# Altium project BoardB.PrjPcb (part 1 of 2)
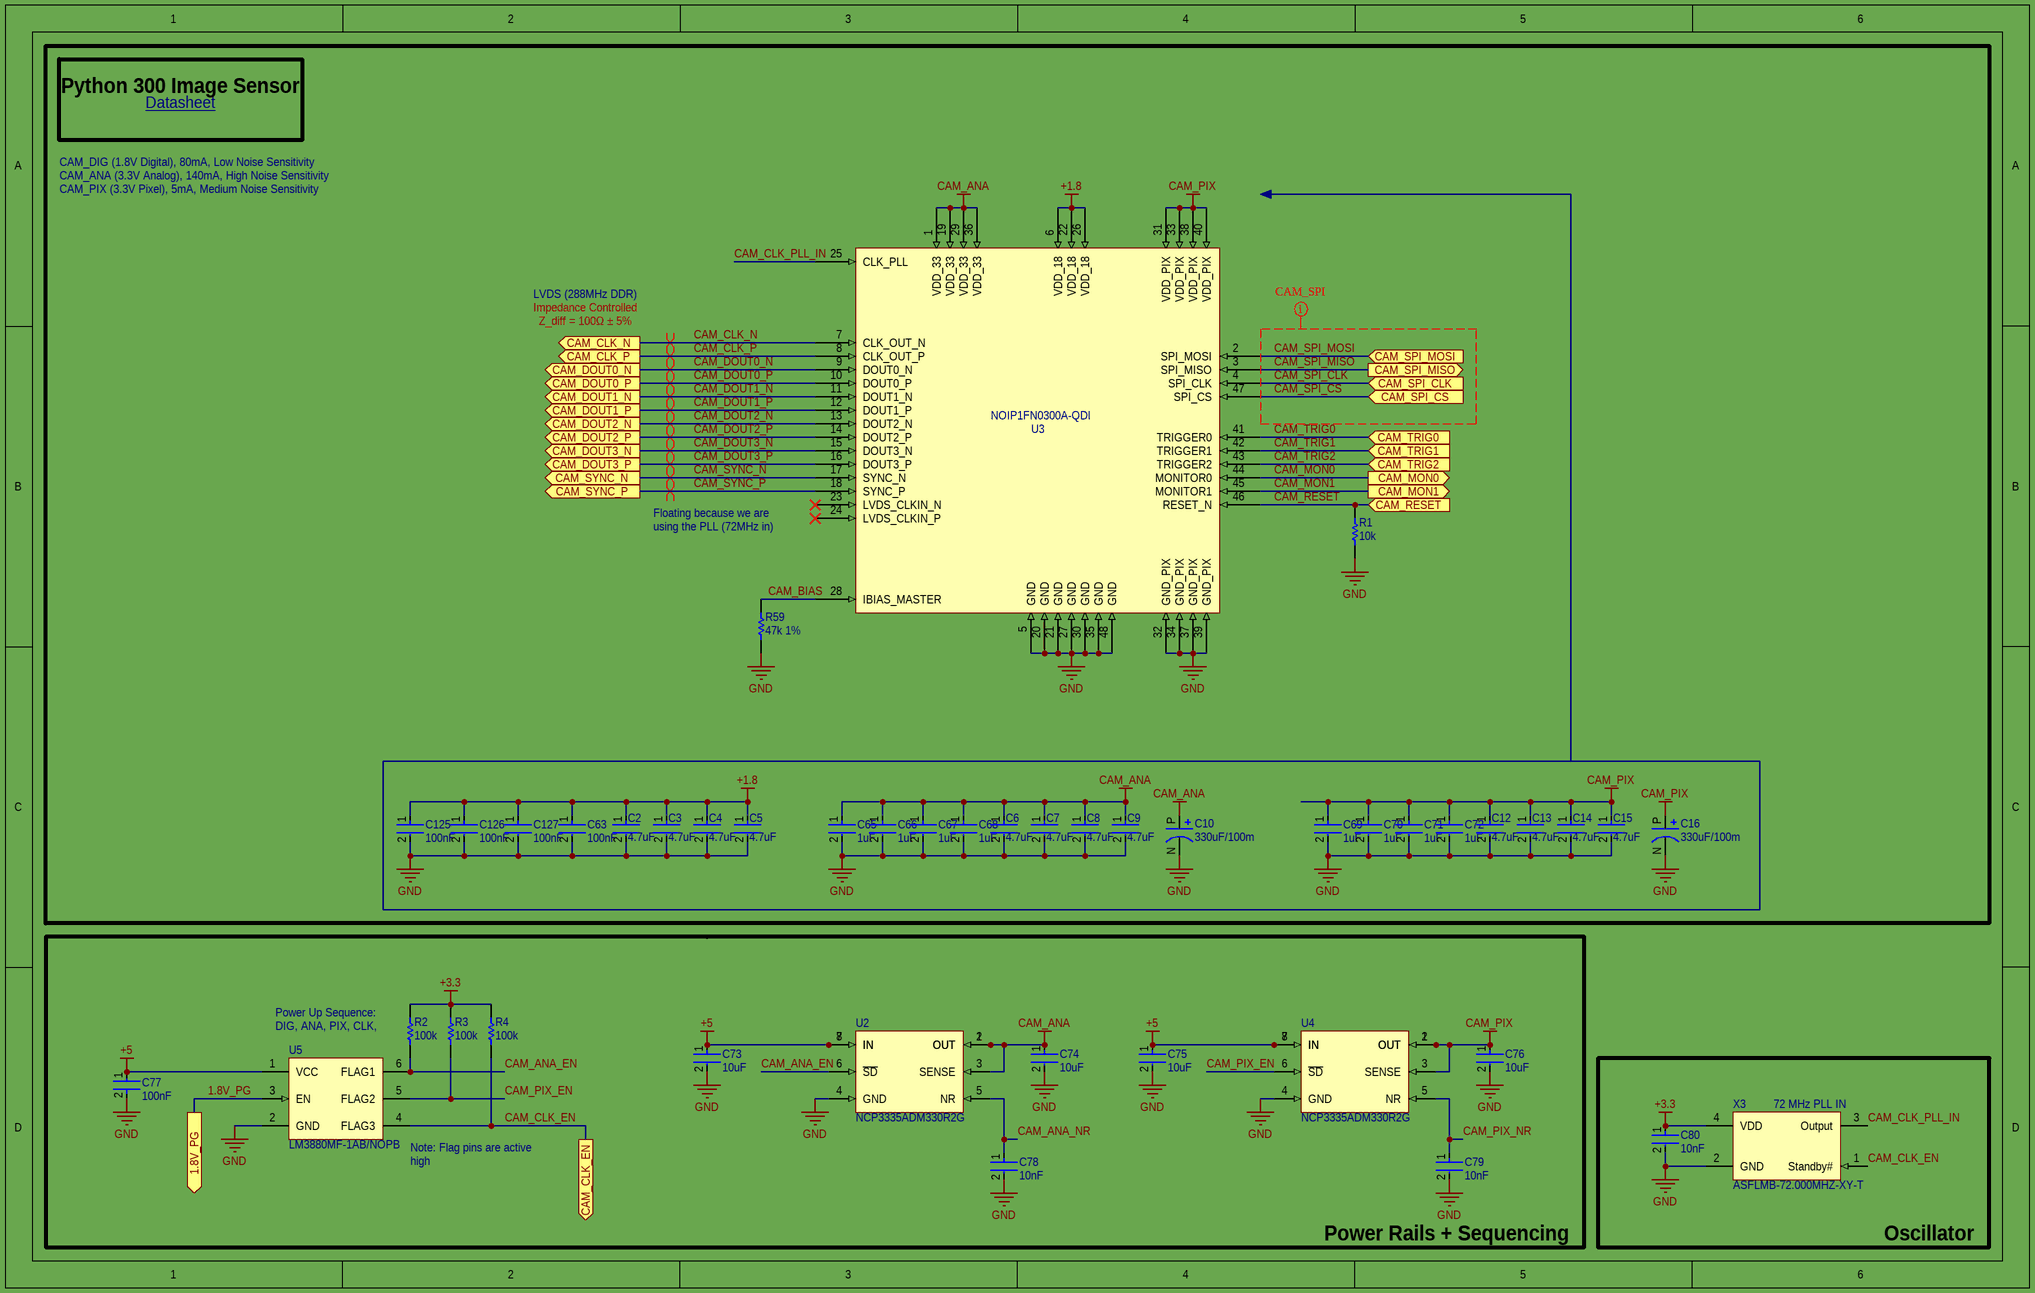
[diagram p0: BoardB-Python.SchDoc]
3 sheets, 129 parts. Net scope: flat (ports and power ports of the same name join across sheets).
Board file: BoardB.PcbDoc
Sheets:
  BoardB-Python.SchDoc
  BoardB-FPGA.SchDoc
  BoardB.SchDoc

## Sheet BoardB-Python.SchDoc
size B; SheetNumber: 1; SheetTotal: 3

### Parts
C2  4.7uF  [FP-GRM155-0_1-IPC_B]
C3  4.7uF  [FP-GRM155-0_1-IPC_B]
C4  4.7uF  [FP-GRM155-0_1-IPC_B]
C5  4.7uF  [FP-GRM155-0_1-IPC_B]
C6  4.7uF  [FP-GRM155-0_1-IPC_B]
C7  4.7uF  [FP-GRM155-0_1-IPC_B]
C8  4.7uF  [FP-GRM155-0_1-IPC_B]
C9  4.7uF  [FP-GRM155-0_1-IPC_B]
C10  330uF/100m  [NOSD337M004R0100]
C12  4.7uF  [FP-GRM155-0_1-IPC_B]
C13  4.7uF  [FP-GRM155-0_1-IPC_B]
C14  4.7uF  [FP-GRM155-0_1-IPC_B]
C15  4.7uF  [FP-GRM155-0_1-IPC_B]
C16  330uF/100m  [NOSD337M004R0100]
C63  100nF  [FP-C0402-BB-MFG]
C65  1uF  [FP-GRM15-0_1-MFG]
C66  1uF  [FP-GRM15-0_1-MFG]
C67  1uF  [FP-GRM15-0_1-MFG]
C68  1uF  [FP-GRM15-0_1-MFG]
C69  1uF  [FP-GRM15-0_1-MFG]
C70  1uF  [FP-GRM15-0_1-MFG]
C71  1uF  [FP-GRM15-0_1-MFG]
C72  1uF  [FP-GRM15-0_1-MFG]
C73  10uF  [FP-CL05A106MP5NUNC-MFG]
C74  10uF  [FP-CL05A106MP5NUNC-MFG]
C75  10uF  [FP-CL05A106MP5NUNC-MFG]
C76  10uF  [FP-CL05A106MP5NUNC-MFG]
C77  100nF  [FP-GRM15-MFG]
C78  10nF  [FP-CC0402-MFG]
C79  10nF  [FP-CC0402-MFG]
C80  10nF  [FP-CC0402-MFG]
C125  100nF  [FP-C0402-BB-MFG]
C126  100nF  [FP-C0402-BB-MFG]
C127  100nF  [FP-C0402-BB-MFG]
R1  10k  [RESC1005X40X25LL05T05]
R2  100k  [RESC1005X40X25ML05T10]
R3  100k  [RESC1005X40X25ML05T10]
R4  100k  [RESC1005X40X25ML05T10]
R59  47k 1%  [RESC1005X40X25NL05T05]
U2  NCP3335ADM330R2G  [NCP3335ADM330R2G]
U3  NOIP1FN0300A-QDI  [NOIP1FN0300A-QDI]
U4  NCP3335ADM330R2G  [NCP3335ADM330R2G]
U5  LM3880MF-1AB/NOPB  [DBV0006A_M]
X3  ASFLMB-72.000MHZ-XY-T  [ASFLMB-72.000MHZ-XY-T]

### Blocks framed on the sheet
Python 300 Image Sensor: C2-C10 C12-C16 C63 C65-C72 C125-C127 R1 R59 U3
Power Rails + Sequencing: C73-C79 R2-R4 U2 U4 U5
Oscillator: C80 X3

### Ports
1.8V_PG (out), CAM_CLK_EN (out), CAM_CLK_N (out), CAM_CLK_P (out), CAM_DOUT0_N (out), CAM_DOUT0_P (out), CAM_DOUT1_N (out), CAM_DOUT1_P (out), CAM_DOUT2_N (out), CAM_DOUT2_P (out), CAM_DOUT3_N (out), CAM_DOUT3_P (out), CAM_MON0 (out), CAM_MON1 (out), CAM_RESET (in), CAM_SPI_CLK (in), CAM_SPI_CS (in), CAM_SPI_MISO (out), CAM_SPI_MOSI (in), CAM_SYNC_N (out), CAM_SYNC_P (out), CAM_TRIG0 (in), CAM_TRIG1 (in), CAM_TRIG2 (in)

### Nets
+1.8: C2.1 C3.1 C4.1 C5.1 C63.1 C125.1 C126.1 C127.1 U3.6(VDD_18) U3.22(VDD_18) U3.26(VDD_18)
+3.3: C80.1 R2.2 R3.2 R4.2 X3.4(VDD)
+5: C73.1 C75.1 C77.1 U2.7(IN) U2.8(IN) U4.7(IN) U4.8(IN) U5.1(VCC)
CAM_ANA: C6.1 C7.1 C8.1 C9.1 C10.P C65.1 C66.1 C67.1 C68.1 C74.1 U2.1(OUT) U2.2(OUT) U2.3(SENSE) U3.1(VDD_33) U3.19(VDD_33) U3.29(VDD_33) U3.36(VDD_33)
CAM_PIX: C12.1 C13.1 C14.1 C15.1 C16.P C69.1 C70.1 C71.1 C72.1 C76.1 U3.31(VDD_PIX) U3.33(VDD_PIX) U3.38(VDD_PIX) U3.40(VDD_PIX) U4.1(OUT) U4.2(OUT) U4.3(SENSE)
GND: C2.2 C3.2 C4.2 C5.2 C6.2 C7.2 C8.2 C9.2 C10.N C12.2 C13.2 C14.2 C15.2 C16.N C63.2 C65.2 C66.2 C67.2 C68.2 C69.2 C70.2 C71.2 C72.2 C73.2 C74.2 C75.2 C76.2 C77.2 C78.2 C79.2 C80.2 C125.2 C126.2 C127.2 R1.1 R59.1 U2.4(GND) U3.5(GND) U3.20(GND) U3.21(GND) U3.27(GND) U3.30(GND) U3.32(GND_PIX) U3.34(GND_PIX) U3.35(GND) U3.37(GND_PIX) U3.39(GND_PIX) U3.48(GND) U4.4(GND) U5.2(GND) X3.2(GND)
1.8V_PG: U5.3(EN) ; port 1.8V_PG
CAM_ANA_EN: R2.1 U2.6(~{SD}) U5.6(FLAG1)
CAM_ANA_NR: C78.1 U2.5(NR)
CAM_BIAS: R59.2 U3.28(IBIAS_MASTER)
CAM_CLK_EN: R4.1 U5.4(FLAG3) X3.1(Standby#) ; port CAM_CLK_EN
CAM_CLK_N: U3.7(CLK_OUT_N) ; port CAM_CLK_N
CAM_CLK_P: U3.8(CLK_OUT_P) ; port CAM_CLK_P
CAM_CLK_PLL_IN: U3.25(CLK_PLL) X3.3(Output)
CAM_DOUT0_N: U3.9(DOUT0_N) ; port CAM_DOUT0_N
CAM_DOUT0_P: U3.10(DOUT0_P) ; port CAM_DOUT0_P
CAM_DOUT1_N: U3.11(DOUT1_N) ; port CAM_DOUT1_N
CAM_DOUT1_P: U3.12(DOUT1_P) ; port CAM_DOUT1_P
CAM_DOUT2_N: U3.13(DOUT2_N) ; port CAM_DOUT2_N
CAM_DOUT2_P: U3.14(DOUT2_P) ; port CAM_DOUT2_P
CAM_DOUT3_N: U3.15(DOUT3_N) ; port CAM_DOUT3_N
CAM_DOUT3_P: U3.16(DOUT3_P) ; port CAM_DOUT3_P
CAM_MON0: U3.44(MONITOR0) ; port CAM_MON0
CAM_MON1: U3.45(MONITOR1) ; port CAM_MON1
CAM_PIX_EN: R3.1 U4.6(~{SD}) U5.5(FLAG2)
CAM_PIX_NR: C79.1 U4.5(NR)
CAM_RESET: R1.2 U3.46(RESET_N) ; port CAM_RESET
CAM_SPI_CLK: U3.4(SPI_CLK) ; port CAM_SPI_CLK
CAM_SPI_CS: U3.47(SPI_CS) ; port CAM_SPI_CS
CAM_SPI_MISO: U3.3(SPI_MISO) ; port CAM_SPI_MISO
CAM_SPI_MOSI: U3.2(SPI_MOSI) ; port CAM_SPI_MOSI
CAM_SYNC_N: U3.17(SYNC_N) ; port CAM_SYNC_N
CAM_SYNC_P: U3.18(SYNC_P) ; port CAM_SYNC_P
CAM_TRIG0: U3.41(TRIGGER0) ; port CAM_TRIG0
CAM_TRIG1: U3.42(TRIGGER1) ; port CAM_TRIG1
CAM_TRIG2: U3.43(TRIGGER2) ; port CAM_TRIG2

Not connected (* = marked no-connect by the designer): U3 23(LVDS_CLKIN_N)* 24(LVDS_CLKIN_P)*

### Layout directives
differential pair; differential pair class CAM_CLK_OUT; rule Signal Stimulus [Kind - Single Pulse    Level - High    Start Time = 0.000    Stop Time = 1.389n    Period Time = 2.778n]: CAM_CLK_N, CAM_CLK_P
differential pair; differential pair class CAM_DOUT0; rule Signal Stimulus [Kind - Single Pulse    Level - High    Start Time = 0.000    Stop Time = 1.389n    Period Time = 2.778n]: CAM_DOUT0_N, CAM_DOUT0_P
differential pair; differential pair class CAM_DOUT1; rule Signal Stimulus [Kind - Single Pulse    Level - High    Start Time = 0.000    Stop Time = 1.389n    Period Time = 2.778n]: CAM_DOUT1_N, CAM_DOUT1_P
differential pair; differential pair class CAM_DOUT2; rule Signal Stimulus [Kind - Single Pulse    Level - High    Start Time = 0.000    Stop Time = 1.389n    Period Time = 2.778n]: CAM_DOUT2_N, CAM_DOUT2_P
differential pair; differential pair class CAM_DOUT3; rule Signal Stimulus [Kind - Single Pulse    Level - High    Start Time = 0.000    Stop Time = 1.389n    Period Time = 2.778n]: CAM_DOUT3_N, CAM_DOUT3_P
differential pair; differential pair class CAM_SYNC; rule Signal Stimulus [Kind - Single Pulse    Level - High    Start Time = 0.000    Stop Time = 1.389n    Period Time = 2.778n]: CAM_SYNC_N, CAM_SYNC_P
mark named CAM_SPI: CAM_SPI_CLK, CAM_SPI_CS, CAM_SPI_MISO, CAM_SPI_MOSI

### Notes on the sheet
- Datasheet <https://www.onsemi.com/pdf/datasheet/noip1sn1300a-d.pdf>
- CAM_DIG (1.8V Digital), 80mA, Low Noise Sensitivity
  CAM_ANA (3.3V Analog), 140mA, High Noise Sensitivity
  CAM_PIX (3.3V Pixel), 5mA, Medium Noise Sensitivity
- LVDS (288MHz DDR)
- Impedance Controlled
- Z_diff = 100Ω ± 5%
- Floating because we are using the PLL (72MHz in)
- (near R2) Power Up Sequence:
  DIG, ANA, PIX, CLK, RESET
- (near X3) 72 MHz PLL IN
- (near U5) Note: Flag pins are active high

### Library data of the parts
C2-C9 C12-C15 = CMP-2008-04549-2: Chip Multilayer Ceramic Capacitors for General Purpose, 0402, 4.7uF, X5R, 15%, 20%, 6.3V; Height: 0.5mm; Weight: 0.000212oz; Length: 1mm; Case Code (Metric): 1005; Packaging: Tape and Reel; Termination: SMD/SMT; Dielectric: X5R; Depth: 0.5mm; Case Code (Imperial): 0402; Min Operating Temperature: -55°C; Case/Package: 0402; Voltage: 6.3V; Width: 0.02inch; Capacitance: 4.7uF; Lead Free: Lead Free; Thickness: 0.022inch; Contact Plating: Tin; REACH SVHC: No SVHC; Package Quantity: 10000; Tolerance: 20%; Voltage Rating (DC): 6.3V; Voltage Rating: 6.3V; Mount: Surface Mount; Max Operating Temperature: 85°C
C10 C16 = NOSD337M004R0100: 330uF +/-20% 4 V dc SMD Niobium Capacitor; 7343-31 package; ESR 0.1Ohms NOS; Manufacturer: Kyocera AVX; Dielectric Material: Tantalum; Voltage Rating: 4V; Tolerance: 20%; ESR (Equivalent Series Resistance): 100mR; Ripple Current: 1.342A; Dissipation Factor: 8%; Leakage Current: 26.4uA; Supplier 1: Arrow Electronics; Manufacturer Part Number: NOSD337M004R0100; RoHS: Yes; Category: Capacitors; Stock 1: 523; Pricing 1: 1=0.86820, 10=0.76450, 25=0.75680, 100=0.63080, 250=0.62450, 500=0.53480 (USD); Mount: Surface Mount; Case/Package: 2917; Case Code (Metric): 7343; Case Code (Imperial): 2917; Min Operating Temperature: -55°C; Max Operating Temperature: 125°C; Package Quantity: 500; Capacitance: 330uF; Packaging: Tape and Reel; Termination: SMD/SMT; Voltage: 4V; Series: NOS; Construction: Flat; Length: 7.3mm; Width: 4.3mm; Height: 2.9mm; Height - Seated (Max): 0.122inch; Depth: 4.3mm; Radiation Hardening: No; REACH SVHC: No SVHC; Lead Free: Lead Free; RoHS Compliant: Yes; ComponentLink1URL: https://datasheet.ciiva.com/257/nos-257040.pdf?src-supplier=Digi-Key; ComponentLink1Description: https://datasheet.ciiva.com/257/nos-257040.pdf?src-supplier=Digi-Key; ComponentLink2URL: https://datasheet.ciiva.com/11790/0900766b8070be5a-11790395.pdf?src-supplier=RSComponents; ComponentLink2Description: https://datasheet.ciiva.com/11790/0900766b8070be5a-11790395.pdf?src-supplier=RSComponents; ComponentLink3URL: https://datasheet.ciiva.com/257/nos-257041.pdf?src-supplier=Digi-Key; ComponentLink3Description: https://datasheet.ciiva.com/257/nos-257041.pdf?src-supplier=Digi-Key; ComponentLink4URL: https://datasheet.ciiva.com/257/nos-257042.pdf?src-supplier=Digi-Key; ComponentLink4Description: https://datasheet.ciiva.com/257/nos-257042.pdf?src-supplier=Digi-Key; ComponentLink5URL: https://datasheet.ciiva.com/2998/nos-2998262.pdf?src-supplier=Avnet; ComponentLink5Description: https://datasheet.ciiva.com/2998/nos-2998262.pdf?src-supplier=Avnet; ComponentLink6URL: https://datasheet.ciiva.com/29882/nos-29882333.pdf?src-supplier=Avnet; ComponentLink6Description: https://datasheet.ciiva.com/29882/nos-29882333.pdf?src-supplier=Avnet; ComponentLink7URL: https://datasheet.ciiva.com/1460/49917-1460418.pdf?src-supplier=Element14; ComponentLink7Description: https://datasheet.ciiva.com/1460/49917-1460418.pdf?src-supplier=Element14; ComponentLink8URL: https://datasheet.ciiva.com/1460/49917-1460419.pdf?src-supplier=Element14; ComponentLink8Description: https://datasheet.ciiva.com/1460/49917-1460419.pdf?src-supplier=Element14; Supplier Part Number 1: NOSD337M004R0100
C63 C125-C127 = CMP-2008-02046-2: CAP CER 0.1UF 10V X5R 0402; Manufacturer: Kemet; Manufacturer Part Number: C0402C104K8PACTU; Material: Ceramic; Capacitance: 0.10 μF; Temperature Coefficient: 15%; Tolerance: 0.1; Value: 0.10 μF; Package: C0402-BB; Temperature: -55°C to +125°C; ComponentLink2Description: Datasheet; Temperature Characteristic: X5R; Device Class L1: Passive Components; Height: 0.55mm; Lead Free: Yes; ComponentLink2URL: https://content.kemet.com/datasheets/KEM_C1002_X7R_SMD.pdf; Device Class L2: Capacitors; Temperature Range Low: -55°C; Temperature Range High: +125°C; RoHS: TRUE; Octopart: https://octopart.com/c0402c104k8pactu-kemet-140039; Automotive: No; Mouser Description: Capacitor 100 nF 10 VDC 0402; Category: Cap; Voltage Rating: 10 V; Digikey Description: CAP CER 0.1UF 10V X5R 0402; Ipc Land Pattern Name: CAPC10050X50; Device Class L3: Ceramic Capacitors
C65-C72 = CMP-2008-04556-2: CAP CER 1UF 10V X5R 0402; Manufacturer Part Number: GRM155R61A105KE15D; Manufacturer: Murata; Material: Ceramic; Tolerance: 10%; Temperature Coefficient: 15%; Octopart: https://octopart.com/grm155r61a105ke15d-murata-197442; Lead Free: Yes; ComponentLink2Description: Datasheet; Temperature: -55°C to +85°C; Temperature Range High: +85°C; Height: 0.55mm; Capacitance: 1uF; Ipc Land Pattern Name: CAPC10050X50; ComponentLink2URL: https://search.murata.co.jp/Ceramy/image/img/A01X/G101/ENG/GRM155R61A105KE15-01A.pdf; Temperature Range Low: -55°C; Device Class L2: Capacitors; Voltage Rating: 10V; RoHS: TRUE; Device Class L1: Passive Components; Device Class L3: Ceramic Capacitors; Temperature Characteristic: X5R; Mouser Description: 0402 1 uF 10 V ±10% Tolerance X5R Surface Mount Multilayer Ceramic Capacitor; Automotive: No; Package: GRM15-0.1; Digikey Description: CAP CER 1UF 10V X5R 0402; Value: 1uF; Category: Cap
C73-C76 = CMP-13271-000002-1: CAP CER 10UF 10V X5R 0402; Manufacturer Part Number: CL05A106MP5NUNC; Manufacturer: Samsung; Temperature Coefficient: 15%; Tolerance: 20%; Material: Ceramic; Octopart: https://octopart.com/cl05a106mp5nunc-samsung-22457395; Voltage Rating: 10V; RoHS: TRUE; Value: 10uF; Height: 0.7mm; Digikey Description: CAP CER 10UF 10V X5R 0402; Automotive: No; Package: CL05A106MP5NUNC; Device Class L1: Passive Components; Capacitance: 10uF; Temperature Range High: +85°C; ComponentLink2Description: Datasheet; Device Class L2: Capacitors; Temperature Characteristic: X5R; Temperature: -55°C to +85°C; ComponentLink2URL: http://www.samsungsem.com/kr/support/product-search/mlcc/__icsFiles/afieldfile/2019/05/10/19-CL05A106MP5NUNC.pdf; Device Class L3: Ceramic Capacitors; Category: Cap; Temperature Range Low: -55°C; Ipc Land Pattern Name: CAPC10050X50; Lead Free: Yes
C77 = CMP-2100-03641-2: CAP CER 0.1UF 16V X7R 0402; Manufacturer Part Number: GRM155R71C104KA88D; Manufacturer: Murata; Standoff Height: 0mm; Tolerance: 10%; Voltage Rating: 16Vdc; Material: Ceramic; Capacitance: 0.10μF; Value: 0.10μF; RoHS: TRUE; Temperature Characteristic: X7R; Octopart: https://octopart.com/grm155r71c104ka88d-murata-196880; Digikey Description: CAP CER 0.1UF 16V X7R 0402; Device Class L3: Ceramic Capacitors; Height: 0.55mm; ComponentLink2Description: Datasheet; Temperature Range Low: -55°C; Ipc Land Pattern Name: CAPC10050X219; ComponentLink2URL: https://search.murata.co.jp/Ceramy/image/img/A01X/G101/ENG/GRM155R71H471KA01-01A.pdf; Device Class L1: Passive Components; Lead Free: yes; Category: Cap; Package: GRM15; Temperature: -55°C to +125°C; Device Class L2: Capacitors; Temperature Range High: +125°C; Mouser Description: 0402 0.1 uF 16V ±10 % Tolerance X7R SMT Multilayer Ceramic Capacitor
C78-C80 = CMP-03422-000501-1: CAP CER 10000PF 16V X7R 0402; Manufacturer Part Number: CC0402KRX7R7BB103; Manufacturer: YAGEO; Automotive Grade: NA; Material: Ceramic; Tolerance: 0.1; Temperature Coefficient: 30ppm/°C; Temperature Range Low: -55°C; Temperature Range High: +125°C; Mouser Description: 0402 10 nF 16 V ±10 % Tolerance X7R SMT Multilayer Ceramic Capacitor; Footprint Url: http://www.yageo.com/exep/pages/download/literatures/UPY-C_GEN_24.pdf; Category: Cap; RoHS: TRUE; Capacitance: 10 nF; ComponentLink2Description: Datasheet; Ipc Land Pattern Name: CAPC10050X50; Value: 10 nF; Automotive: No; ComponentLink2URL: http://www.yageo.com/documents/recent/UPY-GP_NP0_16V-to-50V_16.pdf; Device Class L1: Passive Components; Height: 0.55mm; Temperature Characteristic: X7R; Package: CC0402; Voltage Rating: 16 V; Device Class L3: Ceramic Capacitors; Lead Free: Yes; Device Class L2: Capacitors; Digikey Description: CAP CER 10000PF 16V X7R 0402; Octopart: https://octopart.com/cc0402krx7r7bb103-yageo-192895; Temperature: -55°C to +125°C
R1 = CMP-2000-07588-1: Chip Resistor, 10 KOhm, +/- 1%, 0.1 W, -55 to 155 degC, 0402 (1005 Metric), RoHS, Tape and Reel; Manufacturer: Panasonic; Power Rating: 100mW; Voltage Rating: 50V; Resistance: 10KOhm; Case\/Package: 0402; Temperature Coefficient: 100ppm\/degreesC; RoHSCompliant: True; Lead Free: LeadFree; Package Quantity: 1; Contact Plating: Tin; Length: 1mm; Radiation Hardening: No; REACH SVHC: NoSVHC; Max Operating Temperature: 155degC; Depth: 0.5mm; Case Code (Imperial): 0402; Military Standard: Not; Package Description: 2-Pin Surface Mount Device, Body 1 x 0.5 mm; Termination: SMD/SMT; Case Code (Metric): 1005; Height: 0.35mm; Packaging: TapeandReel; Voltage Rating (DC): 50V; Package Reference: 402; Number of Pins: 2; Tolerance: 1%; Mounting Technology: SurfaceMount; Width: 0.02inch; Mount: SurfaceMount; Datasheet URL: https://industrial.panasonic.com/cdbs/www-data/pdf/RDA0000/AOA0000C304.pdf; Composition: ThickFilm; Datasheet Version: 02/2017; Manufacturer URL: http://www.panasonic.com/; Max Power Dissipation: 100mW; Number of Terminations: 2; Min Operating Temperature: -55degC
R2-R4 = CMP-2002-07343-1: Part Number: RC0402FR-07100KL; Manufacturer: Yageo / Phycomp
R59 = CMP-2002-01155-1: Part Number: ERJ2RKF4702X; Manufacturer: Panasonic
U2 U4 = NCP3335ADM330R2G: Linear Voltage Regulator, LDO, Ultra High Accuracy, Low Iq, 500 mA, V out : 3.3 V; Manufacturer: ON Semiconductor; Min Input Voltage: 2.6V; Max Input Voltage: 16V; Output Voltage: 3.3V; Number of Outputs: 1; Max Output Current: 800mA; Polarity: Positive; Accuracy: 0.9%; Output Type: Fixed; Dropout Voltage: 340mV; Reference Voltage: 1.269V; Supplier 1: Arrow Electronics; Manufacturer Part Number: NCP3335ADM330R2G; RoHS: Yes; Category: Voltage Regulators - Linear; Stock 1: 3509; Pricing 1: 1=1.27050, 10=1.10060, 25=0.93500, 100=0.82150, 250=0.81330, 500=0.66300, 1000=0.61180, 3000=0.57730 (USD); Mount: Surface Mount; Case/Package: MSOP; Number of Pins: 8; Min Operating Temperature: -40°C; Max Operating Temperature: 150°C; Package Quantity: 4000; Output Current: 800mA; Packaging: Tape and Reel; Number of Regulators: 1; Min Output Voltage: 3.3V; Output Voltage Accuracy: 0.9%; Length: 3.1mm; Width: 3.1mm; Height: 0.95mm; Radiation Hardening: No; Lead Free: Lead Free; Halogen Free: Halogen Free; RoHS Compliant: Yes; ComponentLink1URL: https://datasheet.ciiva.com/30476/0900766b8124f876-30476966.pdf?src-supplier=RSComponents; ComponentLink1Description: https://datasheet.ciiva.com/30476/0900766b8124f876-30476966.pdf?src-supplier=RSComponents; ComponentLink2URL: https://datasheet.ciiva.com/2061/ncp3335a-d-2061837.pdf?src-supplier=Digi-Key; ComponentLink2Description: https://datasheet.ciiva.com/2061/ncp3335a-d-2061837.pdf?src-supplier=Digi-Key; ComponentLink3URL: https://datasheet.ciiva.com/2061/ncp3335a-d-2061838.pdf?src-supplier=Digi-Key; ComponentLink3Description: https://datasheet.ciiva.com/2061/ncp3335a-d-2061838.pdf?src-supplier=Digi-Key; ComponentLink4URL: https://datasheet.ciiva.com/16390/ncp3335a-d-16390281.pdf?src-supplier=Future+Electronics; ComponentLink4Description: https://datasheet.ciiva.com/16390/ncp3335a-d-16390281.pdf?src-supplier=Future+Electronics; Supplier Part Number 1: NCP3335ADM330R2G
U3 = NOIP1FN0300A-QDI: IC IMAGE SENSOR 0.3MP 48LCC; Manufacturer: ON Semiconductor; Operating Supply Voltage: 3.4V; Supplier 1: Avnet; Manufacturer Part Number: NOIP1FN0300A-QDI; RoHS: Yes; Category: Optoelectronics; Pricing 1: 6=58.23675, 8=57.37875, 20=56.62800, 30=55.87725, 60=55.12650, 300=53.83950, 600=53.41050 (USD); Mount: Surface Mount; Case/Package: LCC; Number of Pins: 48; Min Operating Temperature: -40°C; Max Operating Temperature: 85°C; Lead Free: Lead Free; RoHS Compliant: Yes; ComponentLink1URL: http://www.onsemi.com/pub_link/Collateral/PB_NOIP1SN1300A-D.PDF?src-supplier=Digi-Key; ComponentLink1Description: http://www.onsemi.com/pub_link/Collateral/PB_NOIP1SN1300A-D.PDF?src-supplier=Digi-Key; ComponentLink2URL: http://www.onsemi.com/pub_link/Collateral/NOIP1SN1300A-D.PDF?src-supplier=Avnet+Asia; ComponentLink2Description: http://www.onsemi.com/pub_link/Collateral/NOIP1SN1300A-D.PDF?src-supplier=Avnet+Asia; Supplier Part Number 1: NOIP1FN0300A-QDI
U5 = CMP-0063-01011-4: Power Sequencer, 6-pin SOT-23, Pb-Free, 1000 Reel; Manufacturer: Texas Instruments; High-Reliability: Y; CompType: MiscPower; PowerWise: N; PackageTopMarking: F21A*XTT; Code_JEDEC: MO-178-AB; PartNumber: LM3880MF-1AB/NOPB; RoHS: Y; PackageReference: DBV0006A; ComponentLink1Description: Datasheet URL; Code_IPC: SOT26A-6; PinCount: 6; PackageDescription: Molded SOT-23, .115 x .063 x .040in Body, 6 Lead, .0375in in Pitch; ComponentLink1URL: http://www.ti.com/general/docs/lit/getliterature.tsp?genericPartNumber=LM3880&fileType=pdf
X3 = ASFLMB-72.000MHZ-XY-T: Silicon Oscillator 72MHz 15pF ±10ppm 4-Pin QFN T/R; Manufacturer: Abracon; Operating Supply Voltage: 3.6V; Max Supply Current: 16mA; Supplier 1: Mouser; Manufacturer Part Number: ASFLMB-72.000MHZ-XY-T; RoHS: Yes; Category: Oscillators; Stock 1: 318; Pricing 1: 1=3.61000, 10=3.45000, 50=3.27000, 100=2.93000, 500=2.76000, 1000=2.40000, 10000=2.40000 (USD); Mount: Surface Mount; Case/Package: SMD/SMT; Number of Pins: 4; Min Operating Temperature: -40°C; Max Operating Temperature: 105°C; Frequency: 72MHz; Load Capacitance: 15pF; Packaging: Tape and Reel; Frequency Stability: 10ppm; Termination: SMD/SMT; Series: Pure Silicon™ ASFLMB; Length: 0.197inch; Width: 0.126inch; Height: 0.035inch; Radiation Hardening: No; ComponentLink1URL: https://datasheet.ciiva.com/870/memspeedproflyerii-870042.pdf?src-supplier=Digi-Key; ComponentLink1Description: https://datasheet.ciiva.com/870/memspeedproflyerii-870042.pdf?src-supplier=Digi-Key; ComponentLink2URL: https://datasheet.ciiva.com/870/memspeedproflyerii-870043.pdf?src-supplier=Digi-Key; ComponentLink2Description: https://datasheet.ciiva.com/870/memspeedproflyerii-870043.pdf?src-supplier=Digi-Key; ComponentLink3URL: https://datasheet.ciiva.com/870/memspeedproflyerii-870044.pdf?src-supplier=Digi-Key; ComponentLink3Description: https://datasheet.ciiva.com/870/memspeedproflyerii-870044.pdf?src-supplier=Digi-Key; ComponentLink4URL: https://datasheet.ciiva.com/3178/asflmb-3178058.pdf?src-supplier=Avnet; ComponentLink4Description: https://datasheet.ciiva.com/3178/asflmb-3178058.pdf?src-supplier=Avnet; ComponentLink5URL: https://datasheet.ciiva.com/13163/asflmb-24525-13163049.pdf?src-supplier=Mouser; ComponentLink5Description: https://datasheet.ciiva.com/13163/asflmb-24525-13163049.pdf?src-supplier=Mouser; Supplier Part Number 1: 815-ASFLMB-72-XY-T

## Sheet BoardB-FPGA.SchDoc
size C; SheetNumber: 2; SheetTotal: 3
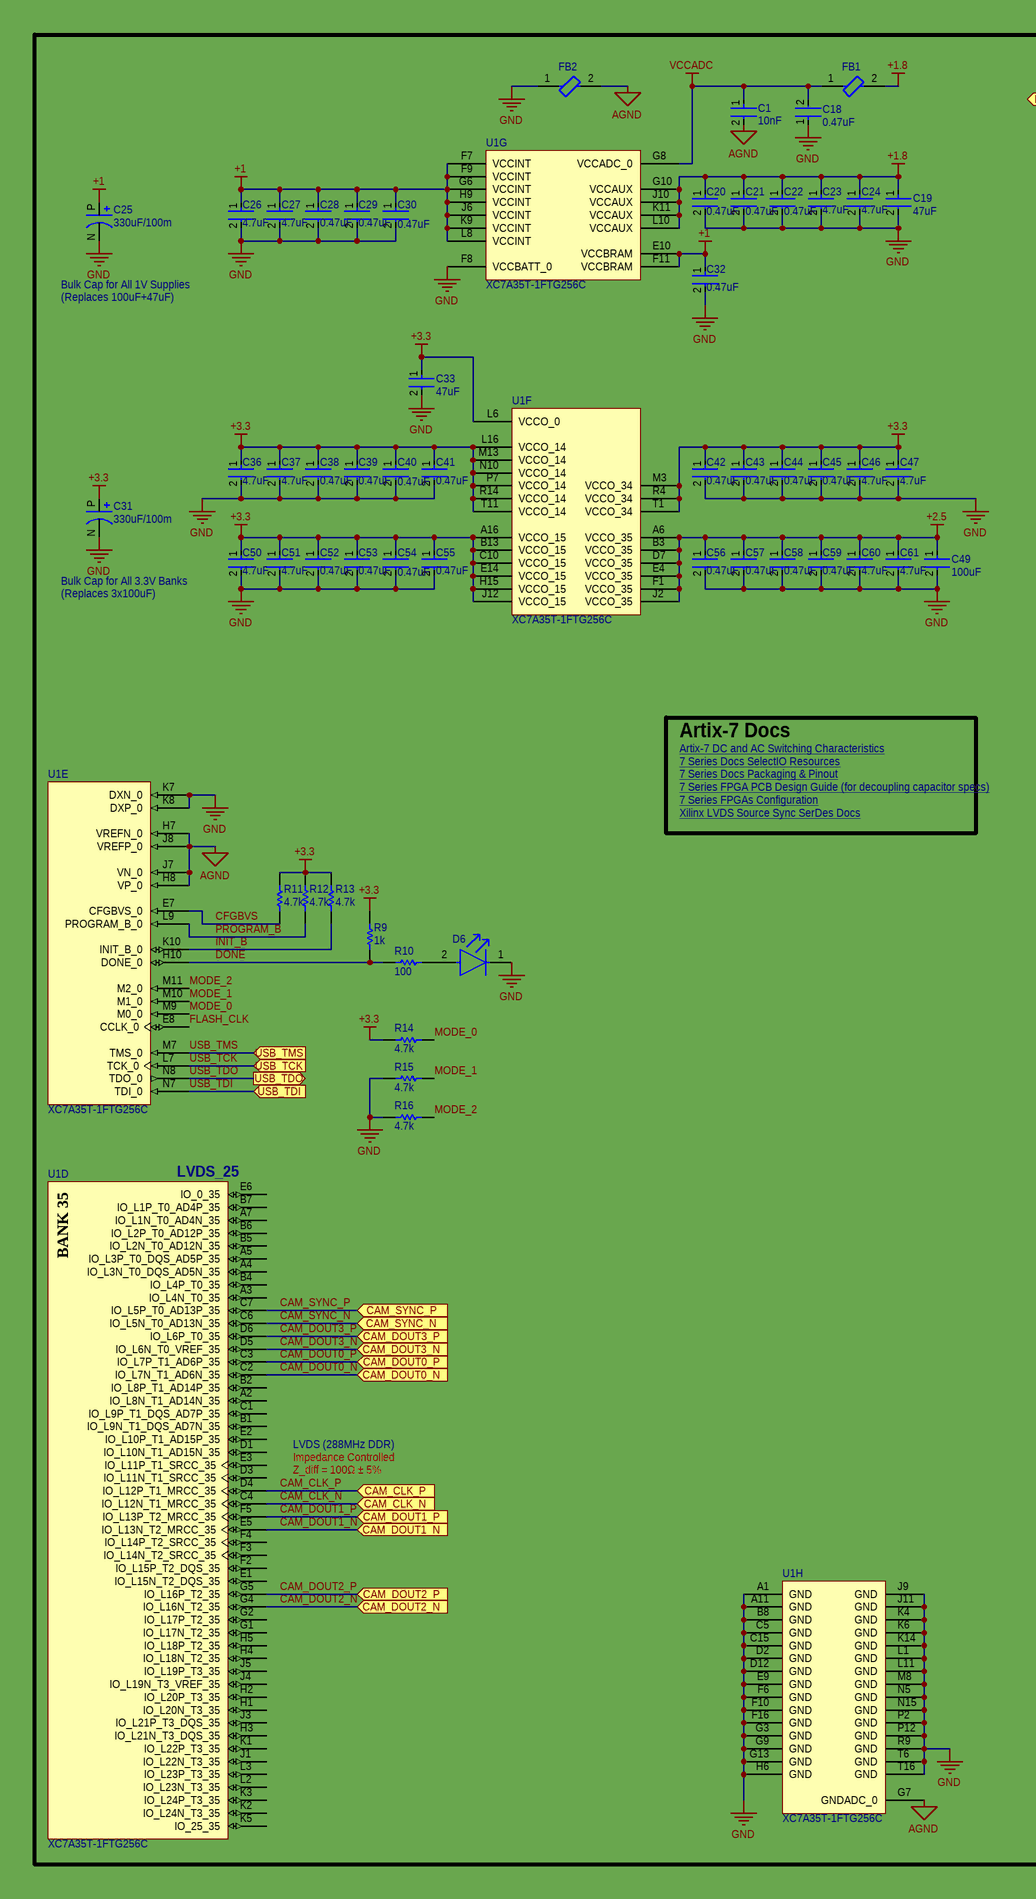
[diagram p1: BoardB-FPGA.SchDoc, left]
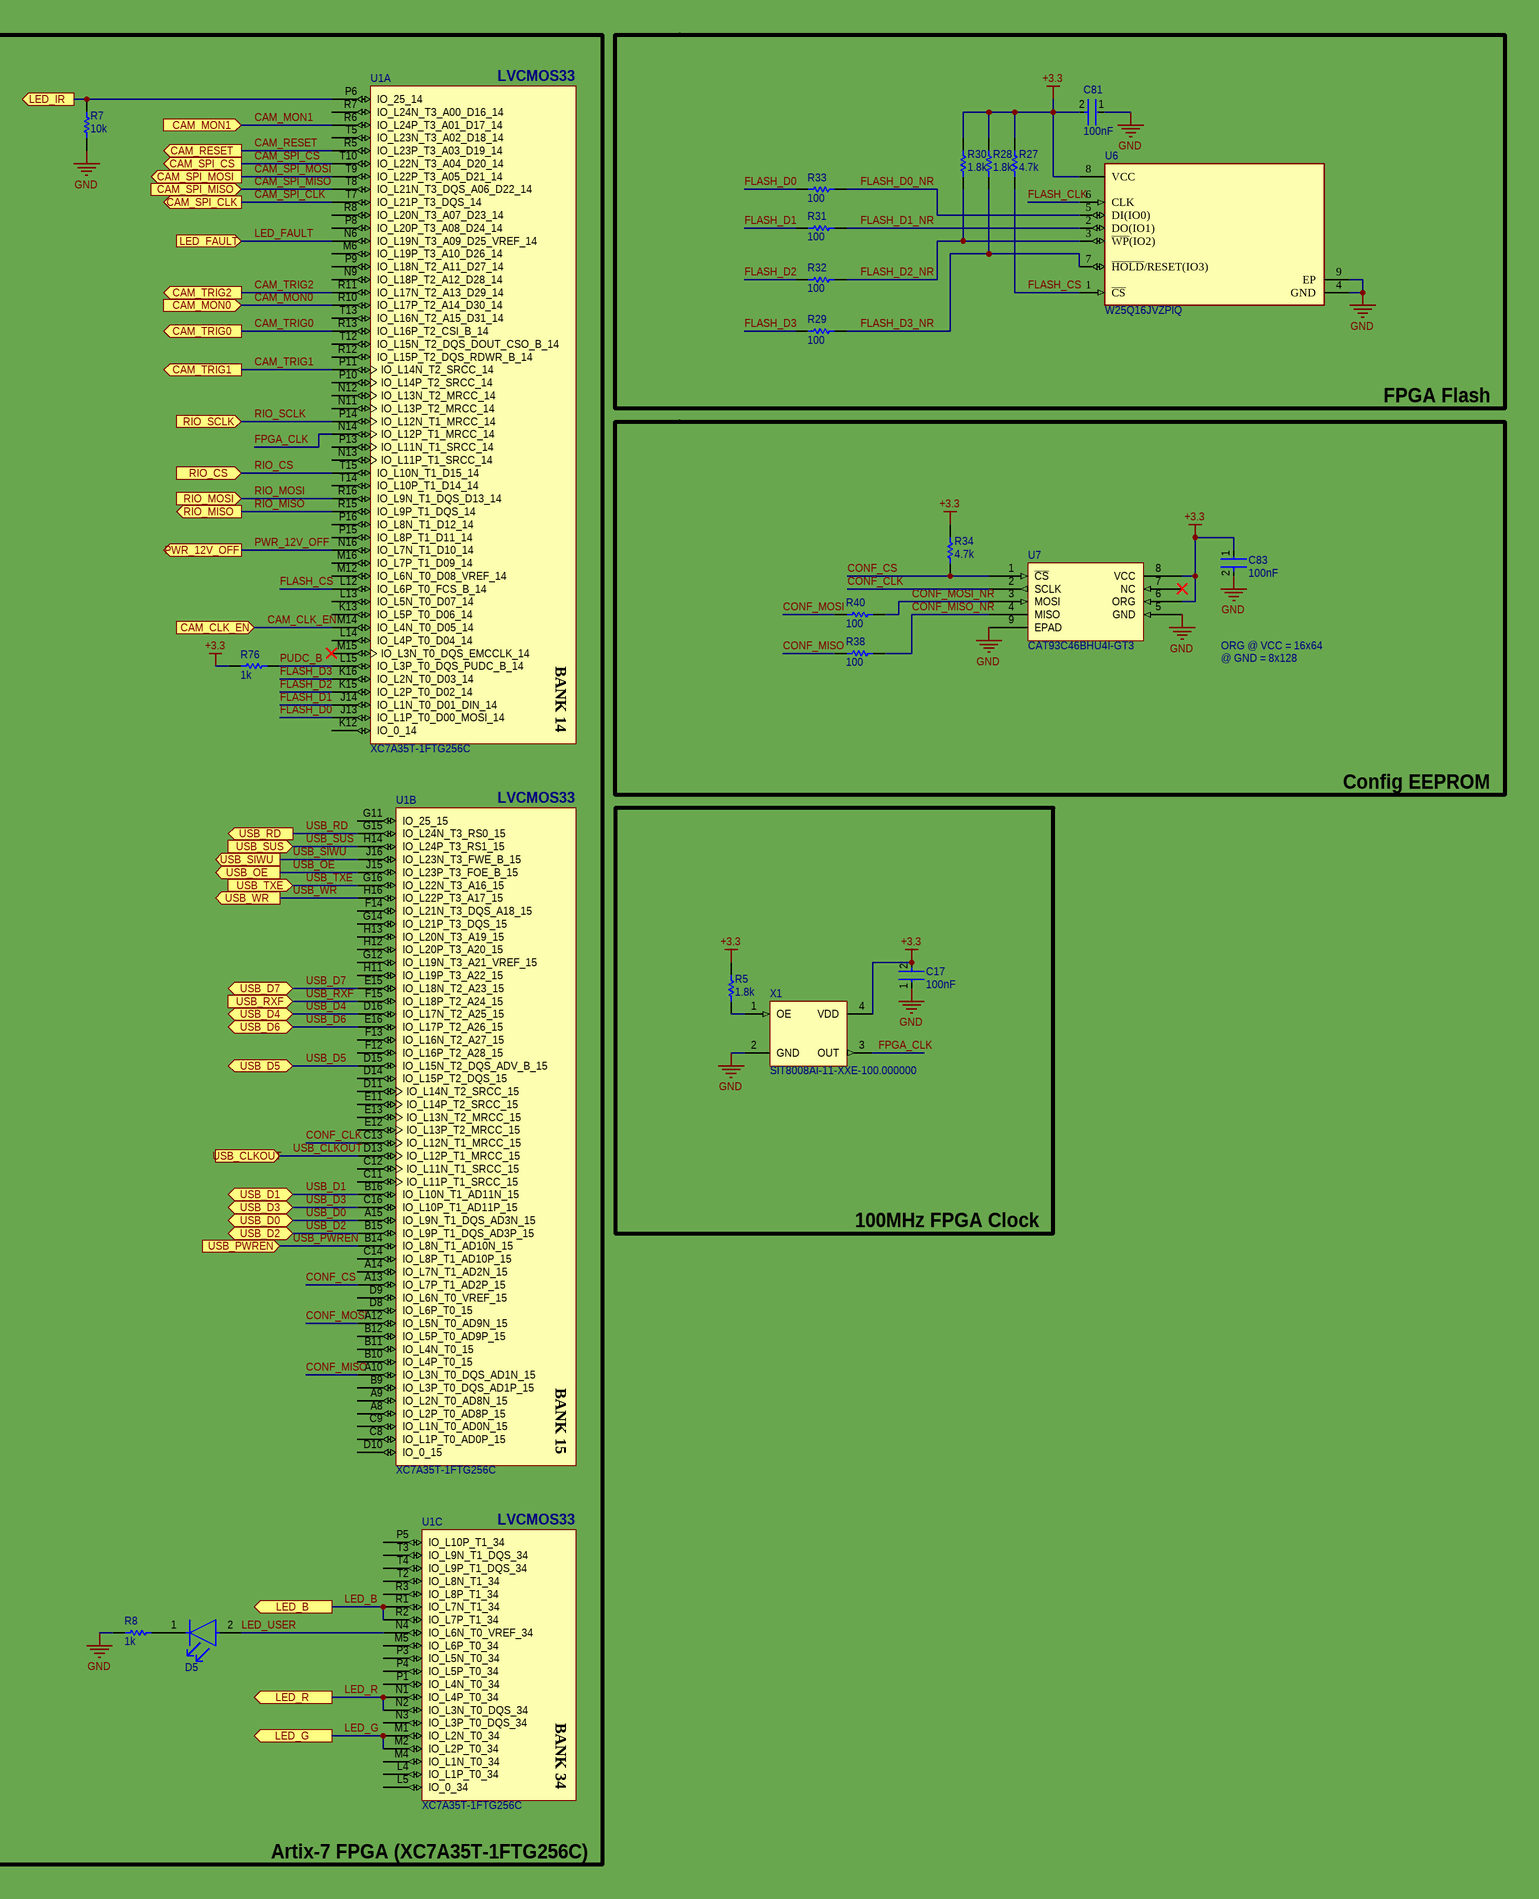
[diagram p2: BoardB-FPGA.SchDoc, right]

### Parts
C1  10nF  [FP-GRM033-0_03-IPC_C]
C17  100nF  [FP-GRM15-IPC_C]
C18  0.47uF  [FP-GRM033-0_03-IPC_C]
C19  47uF  [FP-GRM188-0_2-MFG]
C20  0.47uF  [FP-GRM033-0_03-IPC_C]
C21  0.47uF  [FP-GRM033-0_03-IPC_C]
C22  0.47uF  [FP-GRM033-0_03-IPC_C]
C23  4.7uF  [FP-GRM155-0_1-IPC_B]
C24  4.7uF  [FP-GRM155-0_1-IPC_B]
C25  330uF/100m  [NOSD337M004R0100]
C26  4.7uF  [FP-GRM155-0_1-IPC_B]
C27  4.7uF  [FP-GRM155-0_1-IPC_B]
C28  0.47uF  [FP-GRM033-0_03-IPC_C]
C29  0.47uF  [FP-GRM033-0_03-IPC_C]
C30  0.47uF  [FP-GRM033-0_03-IPC_C]
C31  330uF/100m  [NOSD337M004R0100]
C32  0.47uF  [FP-GRM033-0_03-IPC_C]
C33  47uF  [FP-GRM188-0_2-MFG]
C36  4.7uF  [FP-GRM155-0_1-IPC_B]
C37  4.7uF  [FP-GRM155-0_1-IPC_B]
C38  0.47uF  [FP-GRM033-0_03-IPC_C]
C39  0.47uF  [FP-GRM033-0_03-IPC_C]
C40  0.47uF  [FP-GRM033-0_03-IPC_C]
C41  0.47uF  [FP-GRM033-0_03-IPC_C]
C42  0.47uF  [FP-GRM033-0_03-IPC_C]
C43  0.47uF  [FP-GRM033-0_03-IPC_C]
C44  0.47uF  [FP-GRM033-0_03-IPC_C]
C45  0.47uF  [FP-GRM033-0_03-IPC_C]
C46  4.7uF  [FP-GRM155-0_1-IPC_B]
C47  4.7uF  [FP-GRM155-0_1-IPC_B]
C49  100uF  [FP-GRM21B-0_2-e0_2_0_7-MFG]
C50  4.7uF  [FP-GRM155-0_1-IPC_B]
C51  4.7uF  [FP-GRM155-0_1-IPC_B]
C52  0.47uF  [FP-GRM033-0_03-IPC_C]
C53  0.47uF  [FP-GRM033-0_03-IPC_C]
C54  0.47uF  [FP-GRM033-0_03-IPC_C]
C55  0.47uF  [FP-GRM033-0_03-IPC_C]
C56  0.47uF  [FP-GRM033-0_03-IPC_C]
C57  0.47uF  [FP-GRM033-0_03-IPC_C]
C58  0.47uF  [FP-GRM033-0_03-IPC_C]
C59  0.47uF  [FP-GRM033-0_03-IPC_C]
C60  4.7uF  [FP-GRM155-0_1-IPC_B]
C61  4.7uF  [FP-GRM155-0_1-IPC_B]
C81  100nF  [FP-GRM15-MFG]
C83  100nF  [FP-GRM15-MFG]
D5  SML-D12U1WT86  [FP-SML-D12-MFG]  (value not drawn)
D6  SML-D12U1WT86  [FP-SML-D12-MFG]  (value not drawn)
FB1  BLM18AG601SN1D  [FP-BLM18-0_15-t0_8-MFG]  (value not drawn)
FB2  BLM18AG601SN1D  [FP-BLM18-0_15-t0_8-MFG]  (value not drawn)
R5  1.8k  [RESC1005X40X25LL05T05]
R7  10k  [RESC1005X40X25LL05T05]
R8  1k  [RESC1005X40X25NL05T05]
R9  1k  [RESC1005X40X25NL05T05]
R10  100  [RESC1005X40X25LL05T05]
R11  4.7k  [RESC1005X40X25LL05T05]
R12  4.7k  [RESC1005X40X25LL05T05]
R13  4.7k  [RESC1005X40X25LL05T05]
R14  4.7k  [RESC1005X40X25LL05T05]
R15  4.7k  [RESC1005X40X25LL05T05]
R16  4.7k  [RESC1005X40X25LL05T05]
R27  4.7k  [RESC1005X40X25NL05T05]
R28  1.8k  [RESC1005X40X25LL05T05]
R29  100  [RESC1005X40X25LL05T05]
R30  1.8k  [RESC1005X40X25LL05T05]
R31  100  [RESC1005X40X25LL05T05]
R32  100  [RESC1005X40X25LL05T05]
R33  100  [RESC1005X40X25LL05T05]
R34  4.7k  [RESC1005X40X25NL05T05]
R38  100  [RESC1005X40X25LL05T05]
R40  100  [RESC1005X40X25LL05T05]
R76  1k  [RESC0603X26X15LL03T05]
U1  XC7A35T-1FTG256C  [FTG256]  (parts A,B,C,D,E,F,G,H of 8)
U6  W25Q16JVZPIQ  [FP-ZP-IPC_B]
U7  CAT93C46BHU4I-GT3  [CAT93C46BHU4I-GT3]
X1  SIT8008AI-11-XXE-100.000000  [SIT8008AI-11-XXE-100.000000]

### Blocks framed on the sheet
FPGA Flash: C81 R27-R33 U6
Config EEPROM: C83 R34 R38 R40 U7
100MHz FPGA Clock: C17 R5 X1

### Ports
CAM_CLK_EN (in), CAM_CLK_N (in), CAM_CLK_P (in), CAM_DOUT0_N (in), CAM_DOUT0_P (in), CAM_DOUT1_N (in), CAM_DOUT1_P (in), CAM_DOUT2_N (in), CAM_DOUT2_P (in), CAM_DOUT3_N (in), CAM_DOUT3_P (in), CAM_MON0 (in), CAM_MON1 (in), CAM_RESET (out), CAM_SPI_CLK (out), CAM_SPI_CS (out), CAM_SPI_MISO (in), CAM_SPI_MOSI (out), CAM_SYNC_N (in), CAM_SYNC_P (in), CAM_TRIG0 (out), CAM_TRIG1 (out), CAM_TRIG2 (out), LED_B (out), LED_FAULT (in), LED_G (out), LED_IR (out), LED_R (out), PWR_12V_OFF (out), RIO_CS (in), RIO_MISO (out), RIO_MOSI (in), RIO_SCLK (in), USB_CLKOUT (in), USB_D0 (bidir), USB_D1 (bidir), USB_D2 (bidir), USB_D3 (bidir), USB_D4 (bidir), USB_D5 (bidir), USB_D6 (bidir), USB_D7 (bidir), USB_OE (out), USB_PWREN (in), USB_RD (out), USB_RXF (in), USB_SIWU (out), USB_SUS (in), USB_TCK (in), USB_TDI (in), USB_TDO (out), USB_TMS (in), USB_TXE (in), USB_WR (out)

### Nets
+1: C25.P C26.1 C27.1 C28.1 C29.1 C30.1 C32.1 U1.E10(VCCBRAM) U1.F7(VCCINT) U1.F9(VCCINT) U1.F11(VCCBRAM) U1.G6(VCCINT) U1.H9(VCCINT) U1.J6(VCCINT) U1.K9(VCCINT) U1.L8(VCCINT)
+1.8: C19.1 C20.1 C21.1 C22.1 C23.1 C24.1 FB1.2 U1.G10(VCCAUX) U1.J10(VCCAUX) U1.K11(VCCAUX) U1.L10(VCCAUX)
+2.5: C49.1 C56.1 C57.1 C58.1 C59.1 C60.1 C61.1 U1.A6(VCCO_35) U1.B3(VCCO_35) U1.D7(VCCO_35) U1.E4(VCCO_35) U1.F1(VCCO_35) U1.J2(VCCO_35)
+3.3: C17.2 C31.P C33.1 C36.1 C37.1 C38.1 C39.1 C40.1 C41.1 C42.1 C43.1 C44.1 C45.1 C46.1 C47.1 C50.1 C51.1 C52.1 C53.1 C54.1 C55.1 C81.2 C83.1 R5.2 R9.1 R11.2 R12.2 R13.2 R14.1 R27.2 R28.2 R30.2 R34.2 R76.2 U1.A16(VCCO_15) U1.B13(VCCO_15) U1.C10(VCCO_15) U1.E14(VCCO_15) U1.H15(VCCO_15) U1.J12(VCCO_15) U1.L6(VCCO_0) U1.L16(VCCO_14) U1.M3(VCCO_34) U1.M13(VCCO_14) U1.N10(VCCO_14) U1.P7(VCCO_14) U1.R4(VCCO_34) U1.R14(VCCO_14) U1.T1(VCCO_34) U1.T11(VCCO_14) U6.8(VCC) U7.6(ORG) U7.8(VCC) X1.4(VDD)
AGND: C1.2 FB2.2 U1.G7(GNDADC_0) U1.H7(VREFN_0) U1.H8(VP_0) U1.J7(VN_0) U1.J8(VREFP_0)
GND: C17.1 C18.1 C19.2 C20.2 C21.2 C22.2 C23.2 C24.2 C25.N C26.2 C27.2 C28.2 C29.2 C30.2 C31.N C32.2 C33.2 C36.2 C37.2 C38.2 C39.2 C40.2 C41.2 C42.2 C43.2 C44.2 C45.2 C46.2 C47.2 C49.2 C50.2 C51.2 C52.2 C53.2 C54.2 C55.2 C56.2 C57.2 C58.2 C59.2 C60.2 C61.2 C81.1 C83.2 D6.1(C) FB2.1 R7.2 R8.2 R15.1 R16.1 U1.A1(GND) U1.A11(GND) U1.B8(GND) U1.C5(GND) U1.C15(GND) U1.D2(GND) U1.D12(GND) U1.E9(GND) U1.F6(GND) U1.F8(VCCBATT_0) U1.F10(GND) U1.F16(GND) U1.G3(GND) U1.G9(GND) U1.G13(GND) U1.H6(GND) U1.J9(GND) U1.J11(GND) U1.K4(GND) U1.K6(GND) U1.K7(DXN_0) U1.K8(DXP_0) U1.K14(GND) U1.L1(GND) U1.L11(GND) U1.M8(GND) U1.N5(GND) U1.N15(GND) U1.P2(GND) U1.P12(GND) U1.R9(GND) U1.T6(GND) U1.T16(GND) U6.4(GND) U6.9(EP) U7.5(GND) U7.9(EPAD) X1.2(GND)
VCCADC: C1.1 C18.2 FB1.1 U1.G8(VCCADC_0)
CAM_CLK_EN: U1.M14(IO_L4N_T0_D05_14) ; port CAM_CLK_EN
CAM_CLK_N: U1.C4(IO_L12N_T1_MRCC_35) ; port CAM_CLK_N
CAM_CLK_P: U1.D4(IO_L12P_T1_MRCC_35) ; port CAM_CLK_P
CAM_DOUT0_N: U1.C2(IO_L7N_T1_AD6N_35) ; port CAM_DOUT0_N
CAM_DOUT0_P: U1.C3(IO_L7P_T1_AD6P_35) ; port CAM_DOUT0_P
CAM_DOUT1_N: U1.E5(IO_L13N_T2_MRCC_35) ; port CAM_DOUT1_N
CAM_DOUT1_P: U1.F5(IO_L13P_T2_MRCC_35) ; port CAM_DOUT1_P
CAM_DOUT2_N: U1.G4(IO_L16N_T2_35) ; port CAM_DOUT2_N
CAM_DOUT2_P: U1.G5(IO_L16P_T2_35) ; port CAM_DOUT2_P
CAM_DOUT3_N: U1.D5(IO_L6N_T0_VREF_35) ; port CAM_DOUT3_N
CAM_DOUT3_P: U1.D6(IO_L6P_T0_35) ; port CAM_DOUT3_P
CAM_MON0: U1.R10(IO_L17P_T2_A14_D30_14) ; port CAM_MON0
CAM_MON1: U1.R6(IO_L24P_T3_A01_D17_14) ; port CAM_MON1
CAM_RESET: U1.R5(IO_L23P_T3_A03_D19_14) ; port CAM_RESET
CAM_SPI_CLK: U1.T7(IO_L21P_T3_DQS_14) ; port CAM_SPI_CLK
CAM_SPI_CS: U1.T10(IO_L22N_T3_A04_D20_14) ; port CAM_SPI_CS
CAM_SPI_MISO: U1.T8(IO_L21N_T3_DQS_A06_D22_14) ; port CAM_SPI_MISO
CAM_SPI_MOSI: U1.T9(IO_L22P_T3_A05_D21_14) ; port CAM_SPI_MOSI
CAM_SYNC_N: U1.C6(IO_L5N_T0_AD13N_35) ; port CAM_SYNC_N
CAM_SYNC_P: U1.C7(IO_L5P_T0_AD13P_35) ; port CAM_SYNC_P
CAM_TRIG0: U1.R13(IO_L16P_T2_CSI_B_14) ; port CAM_TRIG0
CAM_TRIG1: U1.P11(IO_L14N_T2_SRCC_14) ; port CAM_TRIG1
CAM_TRIG2: U1.R11(IO_L17N_T2_A13_D29_14) ; port CAM_TRIG2
CFGBVS: R11.1 U1.E7(CFGBVS_0)
CONF_CLK: U1.C13(IO_L12N_T1_MRCC_15) U7.2(SCLK)
CONF_CS: R34.1 U1.A13(IO_L7P_T1_AD2P_15) U7.1(~{CS})
CONF_MISO: R38.1 U1.A10(IO_L3N_T0_DQS_AD1N_15)
CONF_MISO_NR: R38.2 U7.4(MISO)
CONF_MOSI: R40.1 U1.A12(IO_L5N_T0_AD9N_15)
CONF_MOSI_NR: R40.2 U7.3(MOSI)
DONE: R9.2 R10.1 U1.H10(DONE_0)
FLASH_CLK: U1.E8(CCLK_0) U6.6(CLK)
FLASH_CS: R27.1 U1.L12(IO_L6P_T0_FCS_B_14) U6.1(~{CS})
FLASH_D0: R33.1 U1.J13(IO_L1P_T0_D00_MOSI_14)
FLASH_D0_NR: R33.2 U6.5(DI(IO0))
FLASH_D1: R31.1 U1.J14(IO_L1N_T0_D01_DIN_14)
FLASH_D1_NR: R31.2 U6.2(DO(IO1))
FLASH_D2: R32.1 U1.K15(IO_L2P_T0_D02_14)
FLASH_D2_NR: R30.1 R32.2 U6.3(~{WP}(IO2))
FLASH_D3: R29.1 U1.K16(IO_L2N_T0_D03_14)
FLASH_D3_NR: R28.1 R29.2 U6.7(~{HOLD}/RESET(IO3))
FPGA_CLK: U1.N14(IO_L12P_T1_MRCC_14) X1.3(OUT)
INIT_B: R13.1 U1.K10(INIT_B_0)
LED_B: U1.R1(IO_L7N_T1_34) U1.R2(IO_L7P_T1_34) ; port LED_B
LED_FAULT: U1.N6(IO_L19N_T3_A09_D25_VREF_14) ; port LED_FAULT
LED_G: U1.M1(IO_L2N_T0_34) U1.M2(IO_L2P_T0_34) ; port LED_G
LED_IR: R7.1 U1.P6(IO_25_14) ; port LED_IR
LED_R: U1.N1(IO_L4P_T0_34) U1.N2(IO_L3N_T0_DQS_34) ; port LED_R
LED_USER: D5.2(A) U1.N4(IO_L6N_T0_VREF_34)
MODE_0: R14.2 U1.M9(M0_0)
MODE_1: R15.2 U1.M10(M1_0)
MODE_2: R16.2 U1.M11(M2_0)
PROGRAM_B: R12.1 U1.L9(PROGRAM_B_0)
PUDC_B: R76.1 U1.L15(IO_L3P_T0_DQS_PUDC_B_14)
PWR_12V_OFF: U1.N16(IO_L7N_T1_D10_14) ; port PWR_12V_OFF
RIO_CS: U1.T15(IO_L10N_T1_D15_14) ; port RIO_CS
RIO_MISO: U1.R15(IO_L9P_T1_DQS_14) ; port RIO_MISO
RIO_MOSI: U1.R16(IO_L9N_T1_DQS_D13_14) ; port RIO_MOSI
RIO_SCLK: U1.P14(IO_L12N_T1_MRCC_14) ; port RIO_SCLK
USB_CLKOUT: U1.D13(IO_L12P_T1_MRCC_15) ; port USB_CLKOUT
USB_D0: U1.A15(IO_L9N_T1_DQS_AD3N_15) ; port USB_D0
USB_D1: U1.B16(IO_L10N_T1_AD11N_15) ; port USB_D1
USB_D2: U1.B15(IO_L9P_T1_DQS_AD3P_15) ; port USB_D2
USB_D3: U1.C16(IO_L10P_T1_AD11P_15) ; port USB_D3
USB_D4: U1.D16(IO_L17N_T2_A25_15) ; port USB_D4
USB_D5: U1.D15(IO_L15N_T2_DQS_ADV_B_15) ; port USB_D5
USB_D6: U1.E16(IO_L17P_T2_A26_15) ; port USB_D6
USB_D7: U1.E15(IO_L18N_T2_A23_15) ; port USB_D7
USB_OE: U1.J15(IO_L23P_T3_FOE_B_15) ; port USB_OE
USB_PWREN: U1.B14(IO_L8N_T1_AD10N_15) ; port USB_PWREN
USB_RD: U1.G15(IO_L24N_T3_RS0_15) ; port USB_RD
USB_RXF: U1.F15(IO_L18P_T2_A24_15) ; port USB_RXF
USB_SIWU: U1.J16(IO_L23N_T3_FWE_B_15) ; port USB_SIWU
USB_SUS: U1.H14(IO_L24P_T3_RS1_15) ; port USB_SUS
USB_TCK: U1.L7(TCK_0) ; port USB_TCK
USB_TDI: U1.N7(TDI_0) ; port USB_TDI
USB_TDO: U1.N8(TDO_0) ; port USB_TDO
USB_TMS: U1.M7(TMS_0) ; port USB_TMS
USB_TXE: U1.G16(IO_L22N_T3_A16_15) ; port USB_TXE
USB_WR: U1.H16(IO_L22P_T3_A17_15) ; port USB_WR
NetD5_1: D5.1(C) R8.1
NetD6_2: D6.2(A) R10.2
NetR5_1: R5.1 X1.1(OE)

Not connected (* = marked no-connect by the designer): U1 A2(IO_L8N_T1_AD14N_35) A3(IO_L4N_T0_35) A4(IO_L3N_T0_DQS_AD5N_35) A5(IO_L3P_T0_DQS_AD5P_35) A7(IO_L1N_T0_AD4N_35) A8(IO_L2P_T0_AD8P_15) A9(IO_L2N_T0_AD8N_15) A14(IO_L7N_T1_AD2N_15) B1(IO_L9N_T1_DQS_AD7N_35) B2(IO_L8P_T1_AD14P_35) B4(IO_L4P_T0_35) B5(IO_L2N_T0_AD12N_35) B6(IO_L2P_T0_AD12P_35) B7(IO_L1P_T0_AD4P_35) B9(IO_L3P_T0_DQS_AD1P_15) B10(IO_L4P_T0_15) B11(IO_L4N_T0_15) B12(IO_L5P_T0_AD9P_15) C1(IO_L9P_T1_DQS_AD7P_35) C8(IO_L1P_T0_AD0P_15) C9(IO_L1N_T0_AD0N_15) C11(IO_L11P_T1_SRCC_15) C12(IO_L11N_T1_SRCC_15) C14(IO_L8P_T1_AD10P_15) D1(IO_L10N_T1_AD15N_35) D3(IO_L11N_T1_SRCC_35) D8(IO_L6P_T0_15) D9(IO_L6N_T0_VREF_15) D10(IO_0_15) D11(IO_L14N_T2_SRCC_15) D14(IO_L15P_T2_DQS_15) E1(IO_L15N_T2_DQS_35) E2(IO_L10P_T1_AD15P_35) E3(IO_L11P_T1_SRCC_35) E6(IO_0_35) E11(IO_L14P_T2_SRCC_15) E12(IO_L13P_T2_MRCC_15) E13(IO_L13N_T2_MRCC_15) F2(IO_L15P_T2_DQS_35) F3(IO_L14N_T2_SRCC_35) F4(IO_L14P_T2_SRCC_35) F12(IO_L16P_T2_A28_15) F13(IO_L16N_T2_A27_15) F14(IO_L21N_T3_DQS_A18_15) G1(IO_L17N_T2_35) G2(IO_L17P_T2_35) G11(IO_25_15) G12(IO_L19N_T3_A21_VREF_15) G14(IO_L21P_T3_DQS_15) H1(IO_L20N_T3_35) H2(IO_L20P_T3_35) H3(IO_L21N_T3_DQS_35) H4(IO_L18N_T2_35) H5(IO_L18P_T2_35) H11(IO_L19P_T3_A22_15) H12(IO_L20P_T3_A20_15) H13(IO_L20N_T3_A19_15) J1(IO_L22N_T3_35) J3(IO_L21P_T3_DQS_35) J4(IO_L19N_T3_VREF_35) J5(IO_L19P_T3_35) K1(IO_L22P_T3_35) K2(IO_L24N_T3_35) K3(IO_L24P_T3_35) K5(IO_25_35) K12(IO_0_14) K13(IO_L5P_T0_D06_14) L2(IO_L23N_T3_35) L3(IO_L23P_T3_35) L4(IO_L1P_T0_34) L5(IO_0_34) L13(IO_L5N_T0_D07_14) L14(IO_L4P_T0_D04_14) M4(IO_L1N_T0_34) M5(IO_L6P_T0_34) M6(IO_L19P_T3_A10_D26_14) M12(IO_L6N_T0_D08_VREF_14) M15(IO_L3N_T0_DQS_EMCCLK_14)* M16(IO_L7P_T1_D09_14) N3(IO_L3P_T0_DQS_34) N9(IO_L18P_T2_A12_D28_14) N11(IO_L13P_T2_MRCC_14) N12(IO_L13N_T2_MRCC_14) N13(IO_L11P_T1_SRCC_14) P1(IO_L4N_T0_34) P3(IO_L5N_T0_34) P4(IO_L5P_T0_34) P5(IO_L10P_T1_34) P8(IO_L20P_T3_A08_D24_14) P9(IO_L18N_T2_A11_D27_14) P10(IO_L14P_T2_SRCC_14) P13(IO_L11N_T1_SRCC_14) P15(IO_L8P_T1_D11_14) P16(IO_L8N_T1_D12_14) R3(IO_L8P_T1_34) R7(IO_L24N_T3_A00_D16_14) R8(IO_L20N_T3_A07_D23_14) R12(IO_L15P_T2_DQS_RDWR_B_14) T2(IO_L8N_T1_34) T3(IO_L9N_T1_DQS_34) T4(IO_L9P_T1_DQS_34) T5(IO_L23N_T3_A02_D18_14) T12(IO_L15N_T2_DQS_DOUT_CSO_B_14) T13(IO_L16N_T2_A15_D31_14) T14(IO_L10P_T1_D14_14); U7 7(NC)*

### Notes on the sheet
- LVCMOS33
- Bulk Cap for All 1V Supplies
- (Replaces 100uF+47uF)
- (near C50) Bulk Cap for All 3.3V Banks
- (Replaces 3x100uF)
- ORG @ VCC = 16x64
- @ GND = 8x128
- 7 Series Docs Packaging & Pinout <https://www.xilinx.com/support/documentation/user_guides/ug475_7Series_Pkg_Pinout.pdf>
- 7 Series Docs SelectIO Resources <https://www.xilinx.com/support/documentation/user_guides/ug471_7Series_SelectIO.pdf>
- Artix-7 DC and AC Switching Characteristics <https://www.xilinx.com/support/documentation/data_sheets/ds181_Artix_7_Data_Sheet.pdf>
- Artix-7 Docs
- 7 Series FPGA PCB Design Guide (for decoupling capacitor specs) <https://www.xilinx.com/support/documentation/user_guides/ug483_7Series_PCB.pdf>
- Xilinx LVDS Source Sync SerDes Docs <https://www.xilinx.com/content/dam/xilinx/support/documentation/application_notes/xapp585-lvds-source-synch-serdes-clock-multiplication.pdf>
- 7 Series FPGAs Configuration <https://docs.xilinx.com/v/u/en-US/ug470_7Series_Config>
- (near U1) LVDS_25
- LVDS (288MHz DDR)
- Impedance Controlled
- Z_diff = 100Ω ± 5%
- Artix-7 FPGA (XC7A35T-1FTG256C)
- (in symbol CMP-0383-00028-1, part A) BANK 14
- (in symbol CMP-0383-00028-1, part B) BANK 15
- (in symbol CMP-0383-00028-1, part C) BANK 34
- (in symbol CMP-0383-00028-1, part D) BANK 35

### Library data of the parts
C1 = CMP-2010-01684-2: Chip Multilayer Ceramic Capacitors for General Purpose, 0201, 10000pF, X7R, 15%, 10%, 10V; Package Quantity: 1; Width: 0.012inch; Voltage: 10V; Mount: Surface Mount; Capacitance: 10nF; Voltage Rating (DC): 10V; Voltage Rating: 10V; Length: 0.6mm; Packaging: Tape and Reel; Material: Ceramic; Dielectric: X7R; REACH SVHC: No SVHC; Termination: SMD/SMT; Case/Package: 0201; Radiation Hardening: No; Height: 0.3mm; Tolerance: 10%; Case Code (Imperial): 0201; Min Operating Temperature: -55°C; Lead Free: Lead Free; Thickness: 0.013inch; Depth: 0.3mm; Case Code (Metric): 0603; Max Operating Temperature: 125°C
C17 C81 C83 = CMP-2100-03641-2: as C77 on sheet BoardB-Python; RoHS: TRUE; Temperature Characteristic: X7R; Octopart: https://octopart.com/grm155r71c104ka88d-murata-196880; Digikey Description: CAP CER 0.1UF 16V X7R 0402; Device Class L3: Ceramic Capacitors; Height: 0.55mm; ComponentLink2Description: Datasheet; Temperature Range Low: -55°C; Ipc Land Pattern Name: CAPC10050X219; ComponentLink2URL: https://search.murata.co.jp/Ceramy/image/img/A01X/G101/ENG/GRM155R71H471KA01-01A.pdf; Device Class L1: Passive Components; Lead Free: yes; Category: Cap; Package: GRM15; Temperature: -55°C to +125°C; Device Class L2: Capacitors; Temperature Range High: +125°C; Mouser Description: 0402 0.1 uF 16V ±10 % Tolerance X7R SMT Multilayer Ceramic Capacitor
C18 C20-C22 C28-C30 C32 C38-C45 C52-C59 = CMP-06035-010465-1: Chip Multilayer Ceramic Capacitors for General Purpose, 0201, 0.47uF, X5R, 15%, 10%, 6.3V; Capacitance: 470nF; Thickness: 0.013inch; Depth: 0.3mm; Height: 0.3mm; Mount: Surface Mount; Max Operating Temperature: 85°C; Tolerance: 10%; Dielectric: X5R; Length: 0.6mm; Package Quantity: 15000; Weight: 1.2E-05oz; Voltage Rating (DC): 6.3V; Lead Free: Lead Free; Termination: SMD/SMT; Voltage Rating: 6.3V; Case Code (Imperial): 0201; Width: 0.012inch; Case/Package: 0201; Case Code (Metric): 0603; Min Operating Temperature: -55°C; Packaging: Tape and Reel
C19 C33 = CMP-2000-05444-2: Chip Multilayer Ceramic Capacitors for General Purpose, 0603, 47uF, X5R, 15%, 20%, 6.3V; Voltage Rating (DC): 6.3V; Thickness: 0.039inch; Case Code (Imperial): 0603; Packaging: Tape and Reel; Capacitance: 47uF; Width: 0.031inch; Dielectric: X5R; Max Operating Temperature: 85°C; Mount: Surface Mount; Case Code (Metric): 1608; Length: 0.063inch; Voltage Rating: 6.3V; Tolerance: 20%; Case/Package: 0603; Min Operating Temperature: -55°C
C23 C24 C26 C27 C36 C37 C46 C47 C50 C51 C60 C61 = CMP-2008-04549-2: as C2 on sheet BoardB-Python; Height: 0.5mm; Weight: 0.000212oz; Length: 1mm; Case Code (Metric): 1005; Packaging: Tape and Reel; Termination: SMD/SMT; Dielectric: X5R; Depth: 0.5mm; Case Code (Imperial): 0402; Min Operating Temperature: -55°C; Case/Package: 0402; Voltage: 6.3V; Width: 0.02inch; Capacitance: 4.7uF; Lead Free: Lead Free; Thickness: 0.022inch; Contact Plating: Tin; REACH SVHC: No SVHC; Package Quantity: 10000; Tolerance: 20%; Voltage Rating (DC): 6.3V; Voltage Rating: 6.3V; Mount: Surface Mount; Max Operating Temperature: 85°C
C25 C31 = NOSD337M004R0100: as C10 on sheet BoardB-Python; Supplier 1: Arrow Electronics; Manufacturer Part Number: NOSD337M004R0100; RoHS: Yes; Category: Capacitors; Stock 1: 523; Pricing 1: 1=0.86820, 10=0.76450, 25=0.75680, 100=0.63080, 250=0.62450, 500=0.53480 (USD); Mount: Surface Mount; Case/Package: 2917; Case Code (Metric): 7343; Case Code (Imperial): 2917; Min Operating Temperature: -55°C; Max Operating Temperature: 125°C; Package Quantity: 500; Capacitance: 330uF; Packaging: Tape and Reel; Termination: SMD/SMT; Voltage: 4V; Series: NOS; Construction: Flat; Length: 7.3mm; Width: 4.3mm; Height: 2.9mm; Height - Seated (Max): 0.122inch; Depth: 4.3mm; Radiation Hardening: No; REACH SVHC: No SVHC; Lead Free: Lead Free; RoHS Compliant: Yes; ComponentLink1URL: https://datasheet.ciiva.com/257/nos-257040.pdf?src-supplier=Digi-Key; ComponentLink1Description: https://datasheet.ciiva.com/257/nos-257040.pdf?src-supplier=Digi-Key; ComponentLink2URL: https://datasheet.ciiva.com/11790/0900766b8070be5a-11790395.pdf?src-supplier=RSComponents; ComponentLink2Description: https://datasheet.ciiva.com/11790/0900766b8070be5a-11790395.pdf?src-supplier=RSComponents; ComponentLink3URL: https://datasheet.ciiva.com/257/nos-257041.pdf?src-supplier=Digi-Key; ComponentLink3Description: https://datasheet.ciiva.com/257/nos-257041.pdf?src-supplier=Digi-Key; ComponentLink4URL: https://datasheet.ciiva.com/257/nos-257042.pdf?src-supplier=Digi-Key; ComponentLink4Description: https://datasheet.ciiva.com/257/nos-257042.pdf?src-supplier=Digi-Key; ComponentLink5URL: https://datasheet.ciiva.com/2998/nos-2998262.pdf?src-supplier=Avnet; ComponentLink5Description: https://datasheet.ciiva.com/2998/nos-2998262.pdf?src-supplier=Avnet; ComponentLink6URL: https://datasheet.ciiva.com/29882/nos-29882333.pdf?src-supplier=Avnet; ComponentLink6Description: https://datasheet.ciiva.com/29882/nos-29882333.pdf?src-supplier=Avnet; ComponentLink7URL: https://datasheet.ciiva.com/1460/49917-1460418.pdf?src-supplier=Element14; ComponentLink7Description: https://datasheet.ciiva.com/1460/49917-1460418.pdf?src-supplier=Element14; ComponentLink8URL: https://datasheet.ciiva.com/1460/49917-1460419.pdf?src-supplier=Element14; ComponentLink8Description: https://datasheet.ciiva.com/1460/49917-1460419.pdf?src-supplier=Element14; Supplier Part Number 1: NOSD337M004R0100
C49 = CMP-2000-07599-2: Chip Multilayer Ceramic Capacitors for General Purpose, 0805, 100uF, X5R, 15%, 20%, 6.3V; Length: 0.079inch; Dielectric: X5R; Case Code (Metric): 2012; Max Operating Temperature: 85°C; Voltage Rating (DC): 6.3V; Min Operating Temperature: -55°C; Tolerance: 20%; Packaging: Cut Tape; Voltage Rating: 6.3V; Capacitance: 100uF; REACH SVHC: No SVHC; Width: 0.049inch; Mount: Surface Mount; Case/Package: 0805; Case Code (Imperial): 0805; Lead Free: Lead Free; Thickness: 0.057inch
D5 D6 = CMP-08952-000009-1: LED RED DIFFUSED 1608 SMD; Manufacturer: Rohm; Led Orientation: Top View; Power Dissipation: 54mW; Forward Current: 20mA; Wavelength: 620nm; Reverse Voltage: 5V; Luminous Intensity: 63mcd; Forward Voltage: 2.2V; Mouser Description: SML-D12 Series Red 0603 Diffused 63 mcd 2.2 V Surface Mount LED; Temperature: -40°C to +85°C; Device Class L2: LEDs; Lead Free: Yes; Automotive: No; Octopart: https://octopart.com/sml-d12u1wt86-rohm-70850259; RoHS: TRUE; Colour: Red; Digikey Description: LED RED DIFFUSED 1608 SMD; Package: SML-D12; Device Class L1: Optoelectronics; Category: Diode; Temperature Range High: +85°C; Height: 0.65mm; ComponentLink2Description: Datasheet; Temperature Range Low: -40°C; ComponentLink2URL: https://www.rohm.com/datasheet/SML-D12U1W/sml-d12x1-e; Manufacturer Part Number: SML-D12U1WT86; Device Class L3: unset
FB1 FB2 = CMP-0686-00436-3: Chip Ferrite Bead, 0603, 600Ω @ 100MHz, 0.38Ω, 25%, 500mA; Number of Lines: 1; Impedance: 600R; DC Resistance (DCR): 380mR; Material: Steel; Shielding: Unshielded; Max DC Current: 500mA; Termination: SMD/SMT; Military Standard: Not; Number of Circuits: 1; Min Operating Temperature: -55°C; Case Code (Imperial): 0603; Width: 0.8mm; Current Rating: 500mA; Lead Free: Lead Free; Packaging: Tape and Reel; Frequency: 100MHz; Max Operating Temperature: 125°C; DC Current: 500mA; REACH SVHC: No SVHC; Case/Package: 0603; Package Quantity: 1; Height: 0.8mm; Number of Pins: 2; Depth: 0.8mm; Test Frequency: 100MHz; Case Code (Metric): 1608; Tolerance: 25%; Core Material: Ferrite; Weight: 7.1E-05oz; Max Current Rating: 500mA; Radiation Hardening: No; Length: 1.6mm; RoHS Compliant: Yes
R5 R28 R30 = CMP-2002-01128-1: Manufacturer: Panasonic; Part Number: ERJ2RKF1801X
R7 = CMP-2000-07588-1: as R1 on sheet BoardB-Python; RoHSCompliant: True; Lead Free: LeadFree; Package Quantity: 1; Contact Plating: Tin; Length: 1mm; Radiation Hardening: No; REACH SVHC: NoSVHC; Max Operating Temperature: 155degC; Depth: 0.5mm; Case Code (Imperial): 0402; Military Standard: Not; Package Description: 2-Pin Surface Mount Device, Body 1 x 0.5 mm; Termination: SMD/SMT; Case Code (Metric): 1005; Height: 0.35mm; Packaging: TapeandReel; Voltage Rating (DC): 50V; Package Reference: 402; Number of Pins: 2; Tolerance: 1%; Mounting Technology: SurfaceMount; Width: 0.02inch; Mount: SurfaceMount; Datasheet URL: https://industrial.panasonic.com/cdbs/www-data/pdf/RDA0000/AOA0000C304.pdf; Composition: ThickFilm; Datasheet Version: 02/2017; Manufacturer URL: http://www.panasonic.com/; Max Power Dissipation: 100mW; Number of Terminations: 2; Min Operating Temperature: -55degC
R8 R9 = CMP-1011-00510-4: Chip Resistor, 1 KOhm, +/- 1%, 100 mW, -55 to 155 degC, 0402 (1005 Metric), RoHS, Tape and Reel; PartNumber: ERJ-2RKF1001X; Manufacturer: Basic Passives; Voltage Rating: 50 V; Case\/Package: 0402; Resistance: 1 KOhm; Power Rating: 100 mW; DatasheetVersion: 04/2015; Radiation Hardening: No; Pins: 2; Height: 0.35 mm; RoHSCompliant: true; Case Code (Imperial): 0402; ComponentLink2Description: Datasheet; ComponentLink1Description: Manufacturer URL; PackageReference: 0402; Mount: Surface Mount; Package Quantity: 10000; Tolerance: 1%; ComponentLink1URL: http://www.panasonic.com/; PackageDescription: 2-Pin Surface Mount Device, Body 1 x 0.5 mm; Mounting Technology: Surface Mount; Case Code (Metric): 1005; ComponentLink2URL: http://industrial.panasonic.com/cdbs/www-data/pdf/RDA0000/AOA0000C86.pdf; REACH SVHC: Yes; Packaging: Tape and Reel; Max Operating Temperature: 155 degC; Min Operating Temperature: -55 degC; Width: 0.5 mm; Length: 1 mm
R10 R29 R31-R33 R38 R40 = CMP-2002-00605-3: Chip Resistor, 100 Ohm, +/- 1%, 100 mW, -55 to 155 degC, 0402 (1005 Metric), RoHS, Tape and Reel; Manufacturer: Basic Passives; PartNumber: ERJ-2RKF1000X; Power Rating: 100 mW; Resistance: 100 Ohm; Voltage Rating: 50 V; Case\/Package: 0402; Width: 0.5 mm; Pins: 2; ComponentLink2Description: Datasheet; PackageReference: 0402; Height: 0.35 mm; Tolerance: 1%; DatasheetVersion: 04/2015; Case Code (Imperial): 0402; Min Operating Temperature: -55 degC; Radiation Hardening: No; Length: 1 mm; Package Quantity: 10000; PackageDescription: 2-Pin Surface Mount Device, Body 1 x 0.5 mm; Mounting Technology: Surface Mount; Case Code (Metric): 1005; Packaging: Tape and Reel; ComponentLink1URL: http://www.panasonic.com/; RoHSCompliant: true; Max Operating Temperature: 155 degC; REACH SVHC: Yes; ComponentLink1Description: Manufacturer URL; ComponentLink2URL: http://industrial.panasonic.com/cdbs/www-data/pdf/RDA0000/AOA0000C86.pdf; Mount: Surface Mount
R11-R16 R27 R34 = CMP-2002-01154-4: Chip Resistor, 4.7 KOhm, +/- 1%, 0.1 W, -55 to 155 degC, 0402 (1005 Metric), RoHS, Tape and Reel; PartNumber: ERJ-2RKF4701X; Voltage Rating: 50 V; Case\/Package: 0402; Power Rating: 100 mW; Height: 0.35 mm; Mounting Technology: Surface Mount; REACH SVHC: Yes; Resistance: 4.7 KOhm; Max Operating Temperature: 155 degC; ComponentLink1Description: Manufacturer URL; ComponentLink2Description: Datasheet; Pins: 2; PackageReference: 0402; Tolerance: 1%; Case Code (Imperial): 0402; Length: 1 mm; PackageDescription: 2-Pin Surface Mount Device, Body 1 x 0.5 mm; RoHSCompliant: true; Package Quantity: 1; Radiation Hardening: No; DatasheetVersion: 04/2015; Width: 0.5 mm; Case Code (Metric): 1005; Mount: Surface Mount; ComponentLink1URL: http://www.panasonic.com/; Min Operating Temperature: -55 degC; Packaging: Cut Tape; ComponentLink2URL: http://industrial.panasonic.com/cdbs/www-data/pdf/RDA0000/AOA0000C86.pdf
R76 = CMP-1010-00416-2: Manufacturer: Panasonic; Part Number: ERJ1GNF1001C
U1 = CMP-0383-00028-1: Artix-7 FPGA, 170 User I/Os, 0 GTP, 256-Ball BGA, Speed Grade 1, Commercial Grade, Pb-Free; Manufacturer: Xilinx; Speed Grades: 1; Total Block RAM: 1800 Kb; CMTs: 5; GTP: 0; Available User I/O: 170; Logic Cells: 33280; ComponentLink2Description: Datasheet; ComponentLink2URL: http://www.xilinx.com/support/documentation/data_sheets/ds180_7Series_Overview.pdf; ComponentLink1Description: Manufacturer URL; Operating Temperature Range: Commercial; PackageVersion: Rev. 1.11; ComponentLink4URL: http://www.xilinx.com/support/documentation/user_guides/ug475_7Series_Pkg_Pinout.pdf; ComponentLink4Description: Package Specification; PackageDescription: 256-Ball Wire-Bond Fine-Pitch Thin BGA, Body 17 x 17 mm, Pitch 1 mm; Mounting Technology: Surface Mount; ComponentLink1URL: http://www.xilinx.com/; Maximum Distributed RAM: 400 Kb; PackageReference: FTG-256; DatasheetVersion: Rev. 1.15; ComponentLink3Description: Pinout; PartNumber: XC7A35T-1FTG256C; ComponentLink3URL: http://www.xilinx.com/support/documentation/user_guides/ug475_7Series_Pkg_Pinout.pdf
U6 = CMP-78876-000010-1: IC FLASH 16MBIT SPI/QUAD 8WSON; Frequency: 133MHz; Memory Size: 16Mb; Memory Type: Non-Volatile; Packaging: Rail/Tube; Mount: Surface Mount; Min Operating Temperature: -40°C; Max Operating Temperature: 85°C
U7 = CAT93C46BHU4I-GT3: EEPROM Memory IC 1Kb (128 x 8, 64 x 16) SPI 4 MHz 8-UDFN-EP (2x3); ComponentLink1URL: http://www.onsemi.com/pub_link/Collateral/CAT93C46B-D.PDF?src-supplier=Avnet; ComponentLink1Description: http://www.onsemi.com/pub_link/Collateral/CAT93C46B-D.PDF?src-supplier=Avnet; ComponentLink2URL: http://www.onsemi.com/pub/Collateral/CAT93C46B-D.PDF?src-supplier=Digi-Key; ComponentLink2Description: http://www.onsemi.com/pub/Collateral/CAT93C46B-D.PDF?src-supplier=Digi-Key; Supplier 1: Arrow Electronics; Supplier Part Number 1: CAT93C46BHU4I-GT3
X1 = SIT8008AI-11-XXE-100.000000: Oscillator MEMS 100MHz ±20ppm (Stability) 15pF HCMOS/LVCMOS 55% 2.5V/2.8V/3V/3.3V Medical 4-Pin QFN SMD T/R; Manufacturer: SiTime; Manufacturer Part Number: SIT8008AI-11-XXE-100.000000E; Max Supply Current: 4.5mA; Supplier 1: Avnet; RoHS: Yes; Category: Oscillators; Pricing 1: 1000=0.93600, 2000=0.91104, 4000=0.88608, 6000=0.86112, 8000=0.83616 (USD); Mount: Surface Mount; Case/Package: SMD/SMT; Min Operating Temperature: -40°C; Max Operating Temperature: 85°C; Packaging: Tape and Reel; Frequency: 100MHz; Frequency Stability: 20ppm; RoHS Compliant: Yes; ComponentLink1URL: https://media.digikey.com/pdf/Data%20Sheets/SiTime%20PDFs/New_Rev_FAQ.pdf?src-supplier=Digi-Key; ComponentLink1Description: https://media.digikey.com/pdf/Data%20Sheets/SiTime%20PDFs/New_Rev_FAQ.pdf?src-supplier=Digi-Key; Supplier Part Number 1: SIT8008AI-11-XXE-100.000000E